# EAGLE schematic battery pack protection (EAGLE 6.4)

## Sheet 1 of 2
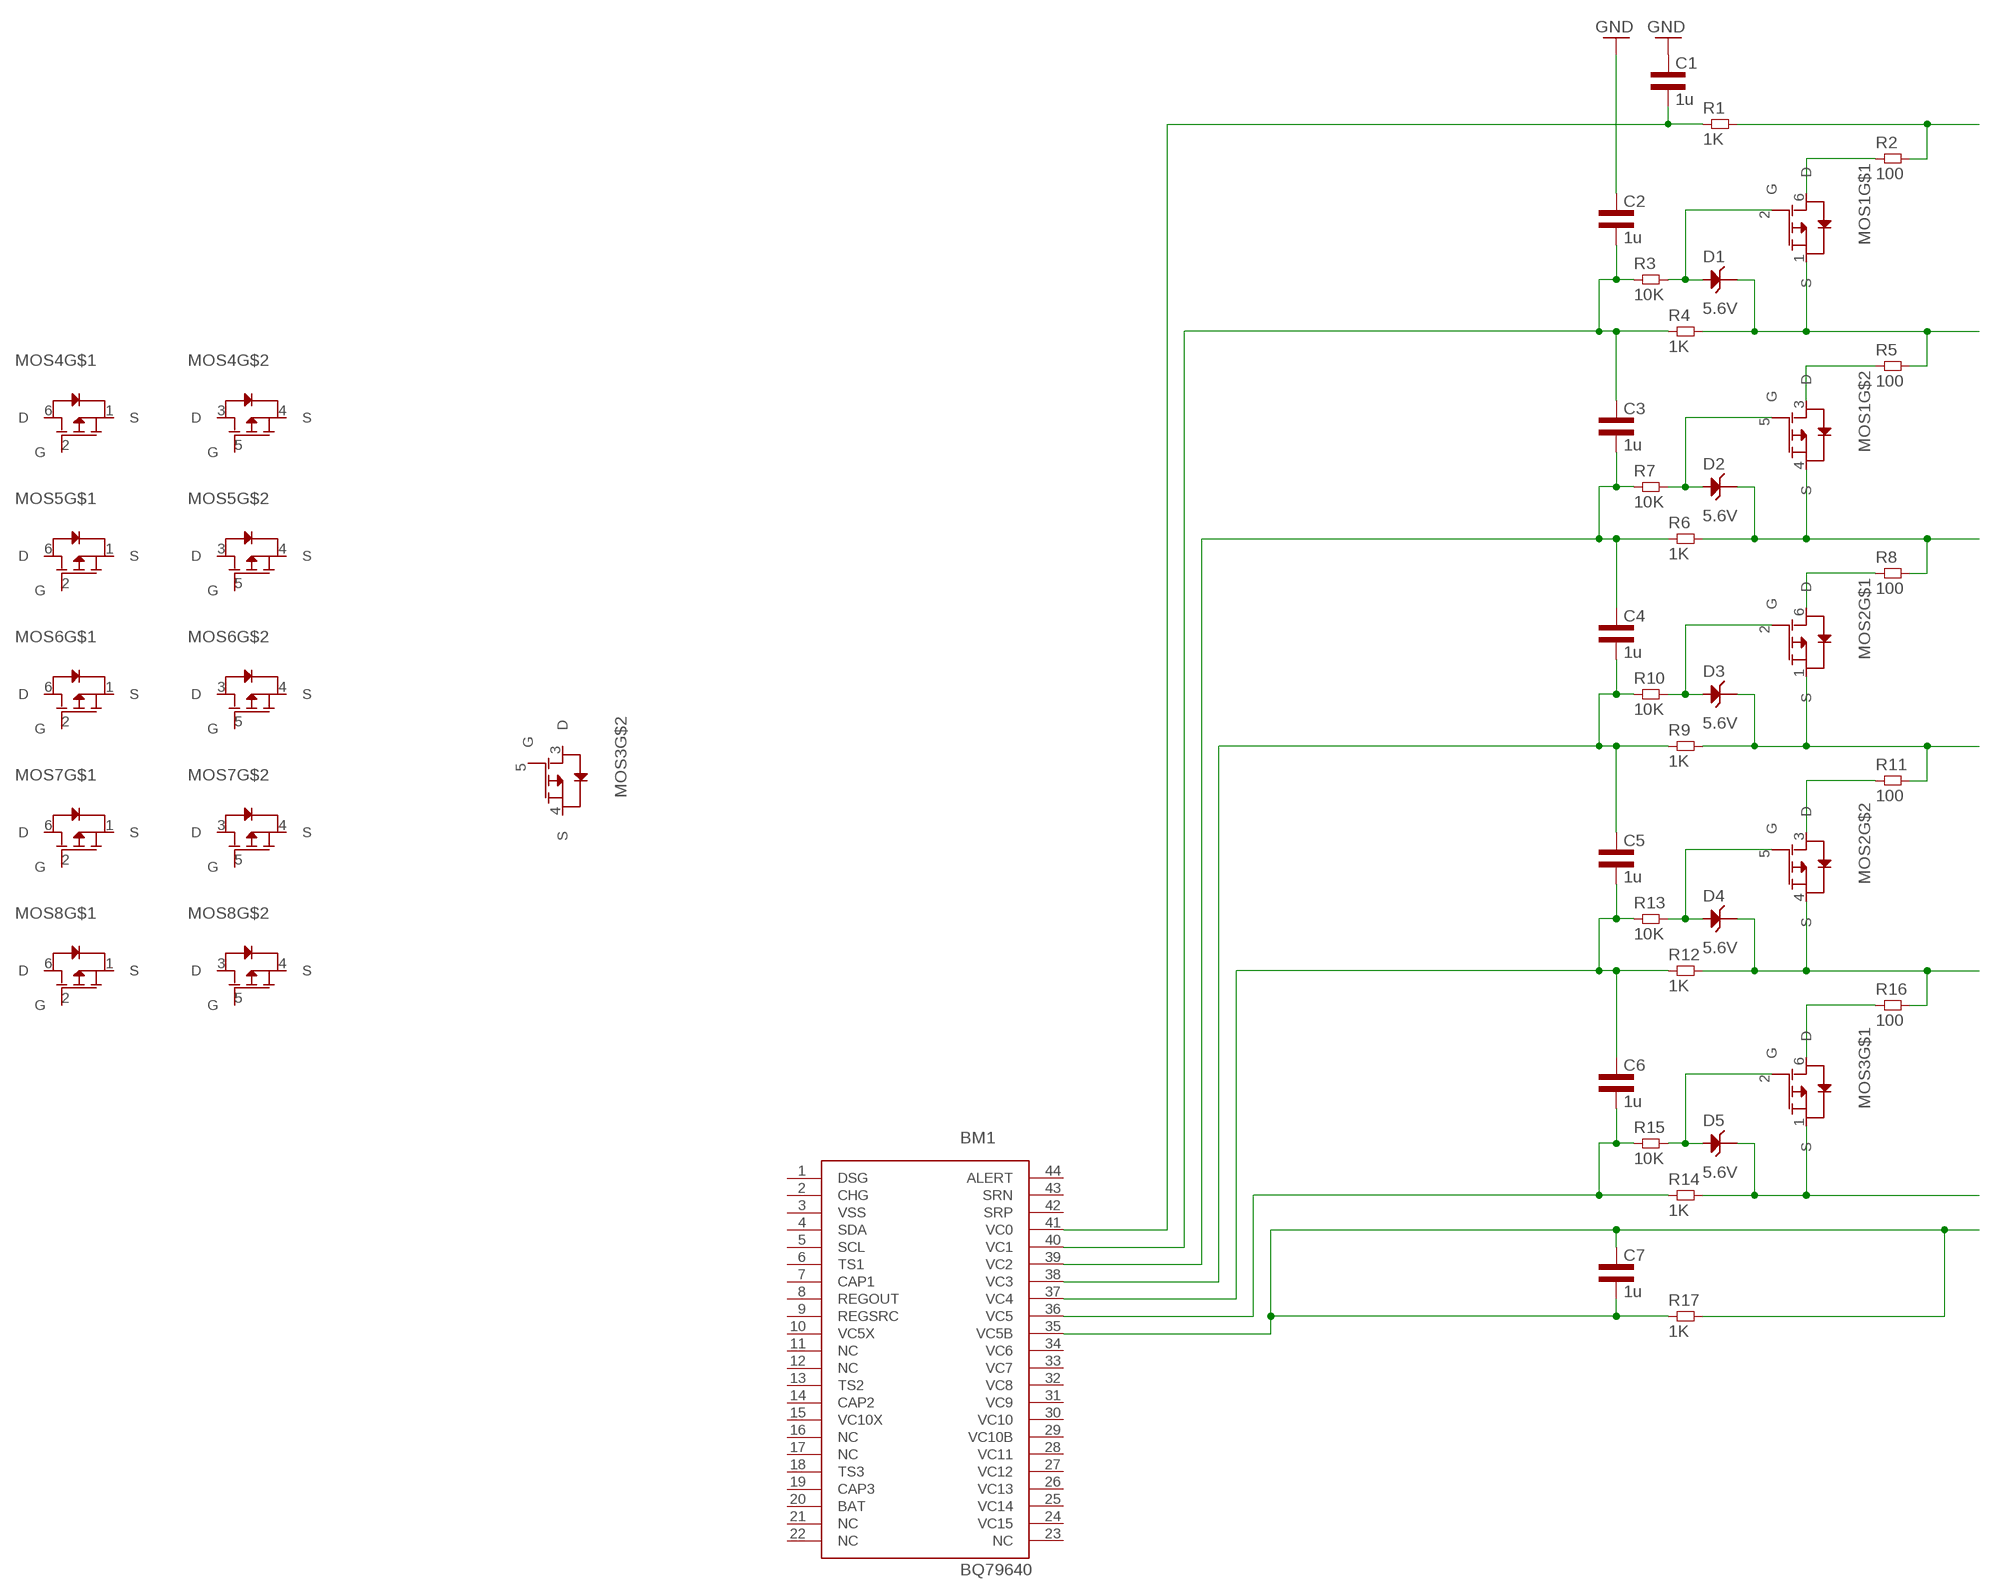
[diagram p0: schematic, sheet 1]

### Parts
BM1  BQ76940  [R-PDSO-G44]
C1  1u  CAP0805L3  [0805L3]
C2  1u  CAP0805L3  [0805L3]
C3  1u  CAP0805L3  [0805L3]
C4  1u  CAP0805L3  [0805L3]
C5  1u  CAP0805L3  [0805L3]
C6  1u  CAP0805L3  [0805L3]
C7  1u  CAP0805L3  [0805L3]
D1  5.6V  ZENERDIODESOD323  [SOD323]
D2  5.6V  ZENERDIODESOD323  [SOD323]
D3  5.6V  ZENERDIODESOD323  [SOD323]
D4  5.6V  ZENERDIODESOD323  [SOD323]
D5  5.6V  ZENERDIODESOD323  [SOD323]
MOS1  FDY1002PZ  [SC89-6]
MOS2  FDY1002PZ  [SC89-6]
MOS3  FDY1002PZ  [SC89-6]
MOS4  FDY1002PZ  [SC89-6]
MOS5  FDY1002PZ  [SC89-6]
MOS6  FDY1002PZ  [SC89-6]
MOS7  FDY1002PZ  [SC89-6]
MOS8  FDY1002PZ  [SC89-6]
R1  1K  RES0805L3  [0805L3]
R2  100  RES1206L3  [1206L3]
R3  10K  RES0805L3  [0805L3]
R4  1K  RES0805L3  [0805L3]
R5  100  RES1206L3  [1206L3]
R6  1K  RES0805L3  [0805L3]
R7  10K  RES0805L3  [0805L3]
R8  100  RES1206L3  [1206L3]
R9  1K  RES0805L3  [0805L3]
R10  10K  RES0805L3  [0805L3]
R11  100  RES1206L3  [1206L3]
R12  1K  RES0805L3  [0805L3]
R13  10K  RES0805L3  [0805L3]
R14  1K  RES0805L3  [0805L3]
R15  10K  RES0805L3  [0805L3]
R16  100  RES1206L3  [1206L3]
R17  1K  RES0805L3  [0805L3]

### Nets
GND: C1.1 C2.1
N$1: BM1.41(VC0) C1.2 R1.1
N$2: R1.2 R2.2
N$3: MOS1.6(D) R2.1
N$4: D1.1(ANODE) MOS1.2(G) R3.2
N$5: D1.2(CATHODE) MOS1.1(S) R4.2 R5.2
N$6: BM1.40(VC1) C2.2 C3.1 R3.1 R4.1
N$7: D2.1(ANODE) MOS1.5(G) R7.2
N$8: BM1.39(VC2) C3.2 C4.1 R6.1 R7.1
N$9: D2.2(CATHODE) MOS1.4(S) R6.2 R8.2
N$10: MOS1.3(D) R5.1
N$11: BM1.38(VC3) C4.2 C5.1 R9.1 R10.1
N$12: D3.1(ANODE) MOS2.2(G) R10.2
N$13: D3.2(CATHODE) MOS2.1(S) R9.2 R11.2
N$14: MOS2.6(D) R8.1
N$15: BM1.37(VC4) C5.2 C6.1 R12.1 R13.1
N$16: D4.2(CATHODE) MOS2.4(S) R12.2 R16.2
N$17: D4.1(ANODE) MOS2.5(G) R13.2
N$18: MOS2.3(D) R11.1
N$19: BM1.36(VC5) C6.2 R14.1 R15.1
N$20: D5.2(CATHODE) MOS3.1(S) R14.2
N$21: MOS3.6(D) R16.1
N$22: D5.1(ANODE) MOS3.2(G) R15.2
N$24: BM1.35(VC5B) C7.1 C7.2 R17.1 R17.2
Unconnected: BM1.1(DSG) BM1.2(CHG) BM1.3(VSS) BM1.4(SDA) BM1.5(SCL) BM1.6(TS1) BM1.7(CAP1) BM1.8(REGOUT) BM1.9(REGSRC) BM1.10(VC5X) BM1.11(NC) BM1.12(NC) BM1.13(TS2) BM1.14(CAP2) BM1.15(VC10X) BM1.16(NC) BM1.17(NC) BM1.18(TS3) BM1.19(CAP3) BM1.20(BAT) BM1.21(NC) BM1.22(NC) BM1.23(NC) BM1.24(VC15) BM1.25(VC14) BM1.26(VC13) BM1.27(VC12) BM1.28(VC11) BM1.29(VC10B) BM1.30(VC10) BM1.31(VC9) BM1.32(VC8) BM1.33(VC7) BM1.34(VC6) BM1.42(SRP) BM1.43(SRN) BM1.44(ALERT) MOS3.3(D) MOS3.4(S) MOS3.5(G) MOS4.1(S) MOS4.2(G) MOS4.3(D) MOS4.4(S) MOS4.5(G) MOS4.6(D) MOS5.1(S) MOS5.2(G) MOS5.3(D) MOS5.4(S) MOS5.5(G) MOS5.6(D) MOS6.1(S) MOS6.2(G) MOS6.3(D) MOS6.4(S) MOS6.5(G) MOS6.6(D) MOS7.1(S) MOS7.2(G) MOS7.3(D) MOS7.4(S) MOS7.5(G) MOS7.6(D) MOS8.1(S) MOS8.2(G) MOS8.3(D) MOS8.4(S) MOS8.5(G) MOS8.6(D)

## Sheet 2 of 2
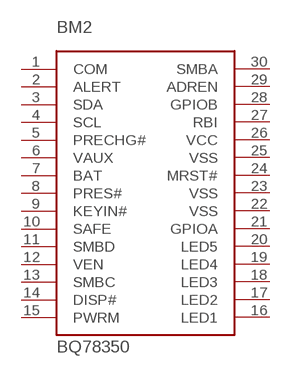
[diagram p1: schematic, sheet 2]

### Parts
BM2  BQ78350  [R-PDSO-G30]
Unconnected: BM2.1(COM) BM2.2(ALERT) BM2.3(SDA) BM2.4(SCL) BM2.5(PRECHG#) BM2.6(VAUX) BM2.7(BAT) BM2.8(PRES#) BM2.9(KEYIN#) BM2.10(SAFE) BM2.11(SMBD) BM2.12(VEN) BM2.13(SMBC) BM2.14(DISP#) BM2.15(PWRM) BM2.16(LED1) BM2.17(LED2) BM2.18(LED3) BM2.19(LED4) BM2.20(LED5) BM2.21(GPIOA) BM2.22(VSS) BM2.23(VSS) BM2.24(MRST#) BM2.25(VSS) BM2.26(VCC) BM2.27(RBI) BM2.28(GPIOB) BM2.29(ADREN) BM2.30(SMBA)

## Library data of the parts
BM1 = battery_management:BQ76940: BQ76940 - 9-15 series cell bttery management and protection.
BM2 = battery_management:BQ78350: BQ78350 - Fuel Gauge and controller for the BQ76940. Fuel gauge for 9-15 series cells.
C1-C7 = common:CAP
D1-D5 = common:ZENERDIODE
MOS1-MOS8 = common:FDY1002PZ
R1-R17 = common:RES